# EAGLE design HighVoltageOutputMirror (EAGLE 9.0.1)
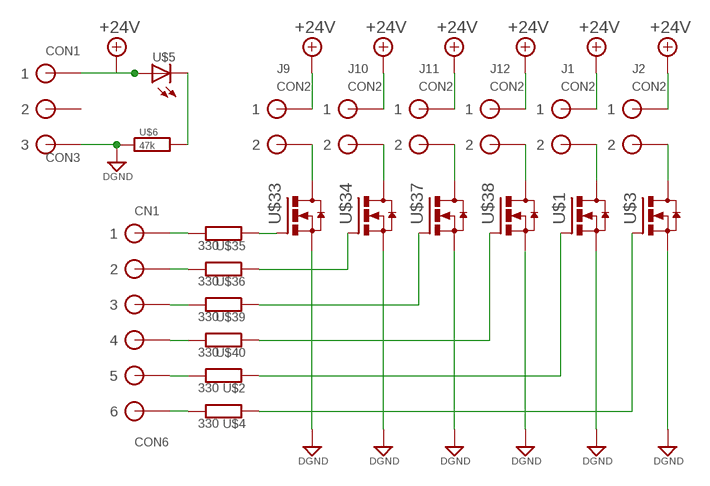
[diagram p0: schematic, sheet 1]

## Parts
CN1  CON6  [CON6]
CON1  CON3  [CON3]
J1  CON2  [CON2]
J2  CON2  [CON2]
J9  CON2  [CON2]
J10  CON2  [CON2]
J11  CON2  [CON2]
J12  CON2  [CON2]
U$1  TO-252(MOS-FET_N)TO-252FORHAND  [TO-252FORHAND]
U$2  330  抵抗0207/10  [1/4W-H4_(0207/10)]
U$3  TO-252(MOS-FET_N)TO-252FORHAND  [TO-252FORHAND]
U$4  330  抵抗0207/10  [1/4W-H4_(0207/10)]
U$5  LED(砲弾型)3  [LED3MM]
U$6  47k  抵抗0805  [0805(JIS2012)HAND]
U$33  TO-252(MOS-FET_N)TO-252FORHAND  [TO-252FORHAND]
U$34  TO-252(MOS-FET_N)TO-252FORHAND  [TO-252FORHAND]
U$35  330  抵抗0207/10  [1/4W-H4_(0207/10)]
U$36  330  抵抗0207/10  [1/4W-H4_(0207/10)]
U$37  TO-252(MOS-FET_N)TO-252FORHAND  [TO-252FORHAND]
U$38  TO-252(MOS-FET_N)TO-252FORHAND  [TO-252FORHAND]
U$39  330  抵抗0207/10  [1/4W-H4_(0207/10)]
U$40  330  抵抗0207/10  [1/4W-H4_(0207/10)]

## Nets
+24V: CON1.P$1 J1.P$1 J2.P$1 J9.P$1 J10.P$1 J11.P$1 J12.P$1 U$5.A
DGND: CON1.P$3 U$1.2(S) U$3.2(S) U$6.1 U$33.2(S) U$34.2(S) U$37.2(S) U$38.2(S)
N$1: CN1.P$5 U$2.2
N$2: U$1.1(G) U$2.1
N$3: J1.P$2 U$1.3(D)
N$4: CN1.P$6 U$4.2
N$5: U$3.1(G) U$4.1
N$6: J2.P$2 U$3.3(D)
N$7: CN1.P$2 U$36.2
N$8: U$5.K U$6.2
N$25: CN1.P$1 U$35.2
N$27: CN1.P$3 U$39.2
N$28: CN1.P$4 U$40.2
N$32: U$33.1(G) U$35.1
N$33: U$34.1(G) U$36.1
N$34: J9.P$2 U$33.3(D)
N$35: J10.P$2 U$34.3(D)
N$36: U$37.1(G) U$39.1
N$37: U$38.1(G) U$40.1
N$38: J11.P$2 U$37.3(D)
N$39: J12.P$2 U$38.3(D)
Unconnected: CON1.P$2

## Library data of the parts
CN1 = (コネクタ)XH:CON6: low insertion connector 6
CON1 = (コネクタ)XH:CON3: low insertion CON
J1 J2 J9-J12 = (コネクタ)XH:CON2: low insertion CON
U$1 U$3 U$33 U$34 U$37 U$38 = (半導体)FET＆トランジスタ:TO-252(MOS-FET_N)
U$2 U$4 U$35 U$36 U$39 U$40 = (Foundation)抵抗:抵抗: RESISTOR, European symbol
U$5 = (半導体)LED:LED(砲弾型)
U$6 = (Foundation)表面実装RC:抵抗

## Board
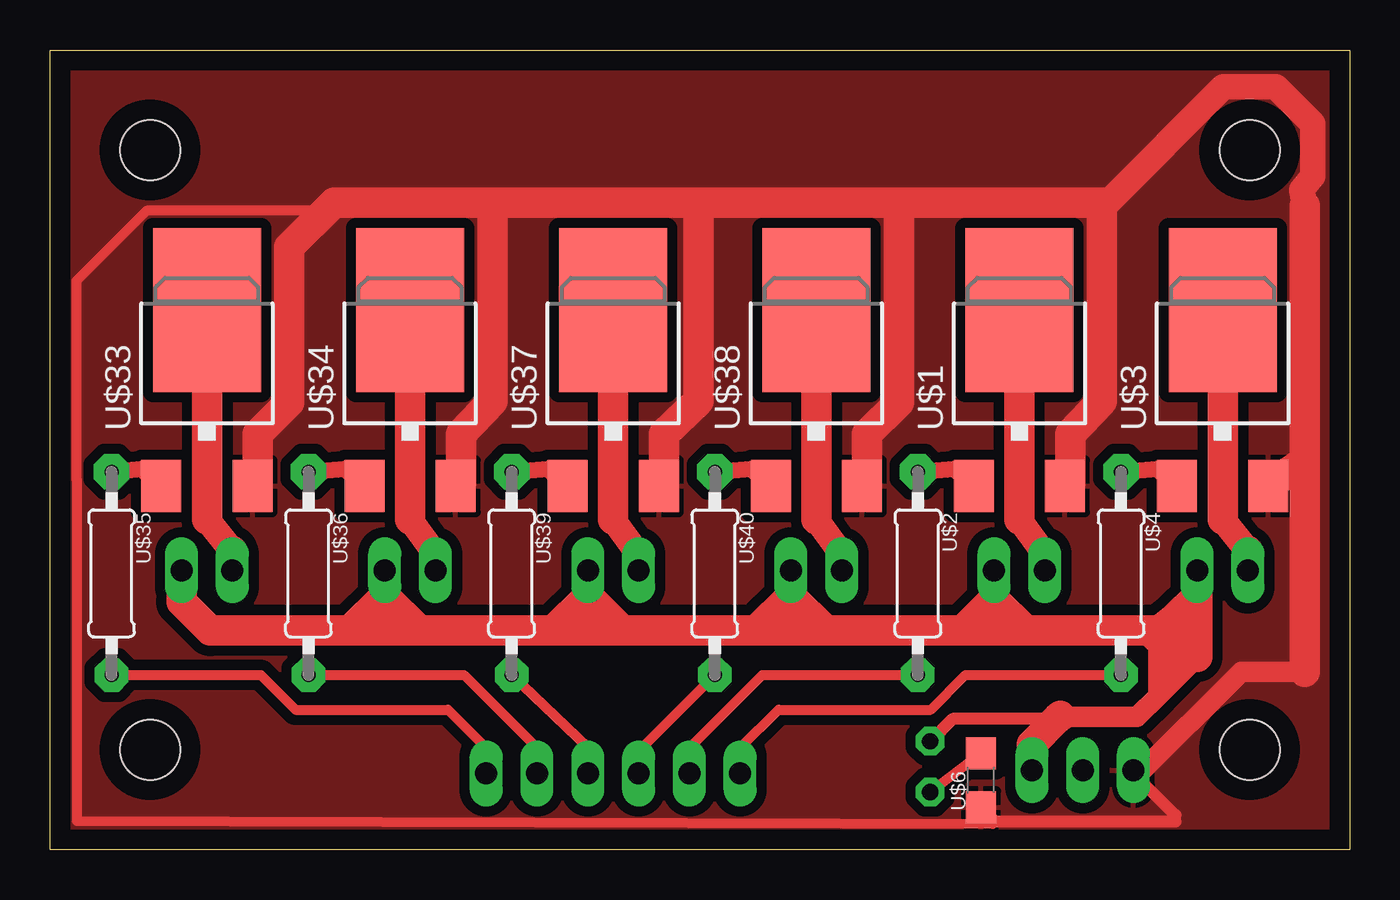
[diagram p1: board, top side]
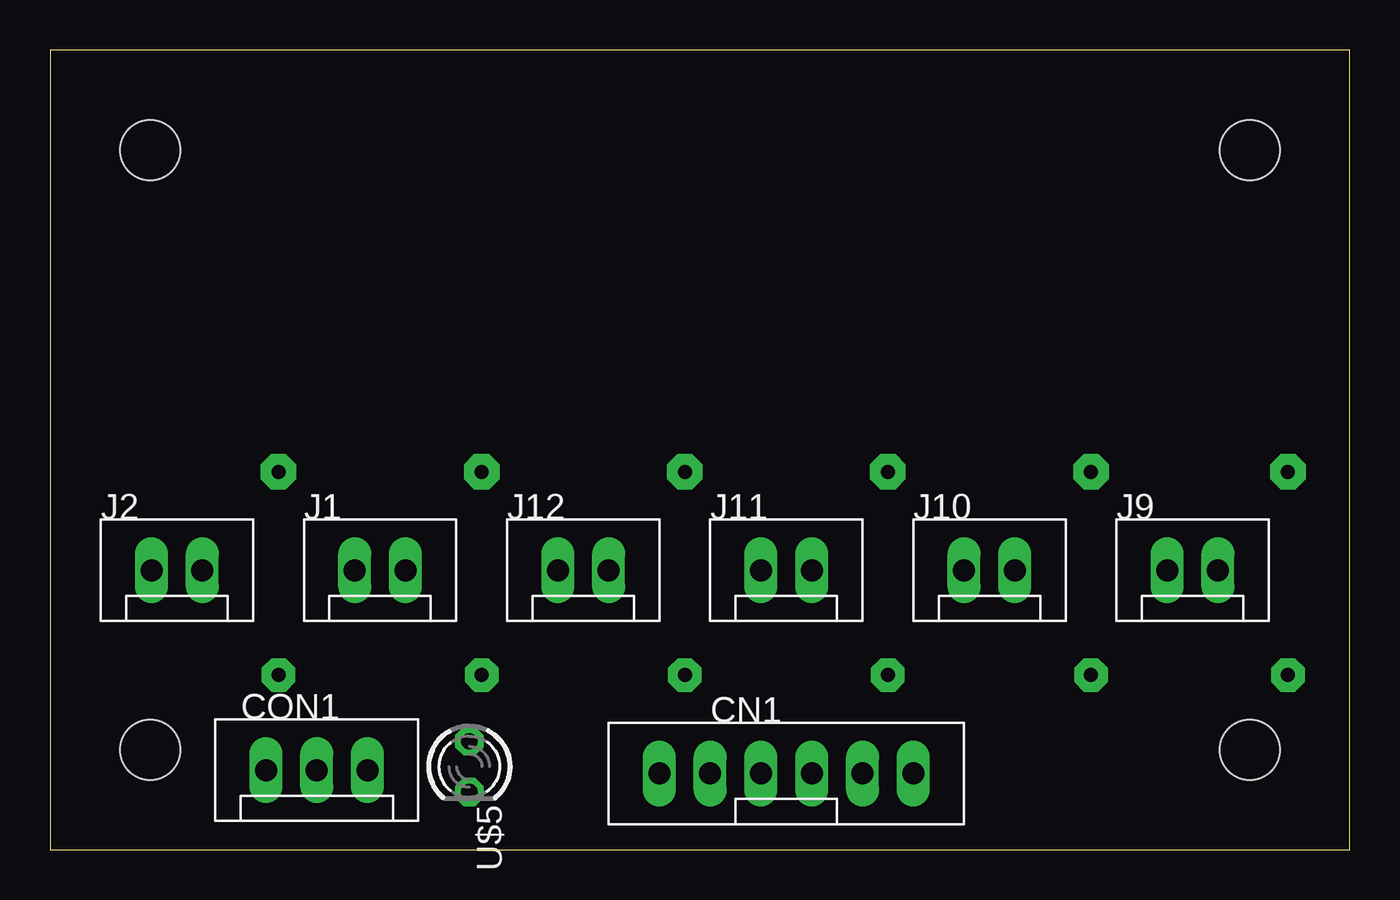
[diagram p2: board, bottom side, seen from below]

Size 65 x 40 mm. Coordinates in mm from the lower left corner, seen from the top.
Outline: 65,0 0,0 0,40 65,40 65,0
Copper layers (1*16): Top 0.035mm / dielectric 1.5mm / Bottom 0.035mm
Design rules "default *": minimum track width 6mil, minimum drill 0.35mm, track to track 20mil, track to pad 20mil, pad to pad 20mil, via to via 20mil, smd to smd 6mil, copper to edge 40mil, drill to drill 6mil, minimum pad ring 10mil, minimum via ring 8mil, stop-mask expansion 4mil, vias tented up to drill 0mil, thermal gap 10mil
Holes 3 mm at 60,5 5,5 5,35 60,35

### Footprints (pad centres in the part's own frame; a part is rotated, then mirrored left to right if it is on the bottom)
CON6 = drill 1.1 long: P$1 6.35,0; P$2 3.81,0; P$3 1.27,0; P$4 -1.27,0; P$5 -3.81,0; P$6 -6.35,0
CON3 = drill 1.1 long: P$1 2.54,0; P$2 0,0; P$3 -2.54,0
CON2 = drill 1.1 long: P$1 1.27,0; P$2 -1.27,0
TO-252FORHAND = smd 2 x 2.6: 1 -2.28,-5.3; 2 2.28,-5.3 | smd 5.4 x 8.2: 3 0,3.5
1/4W-H4_(0207/10) = drill 0.7 pad 1.778 octagon: 1 -5.08,0 | drill 0.7 pad 1.676 octagon: 2 5.08,0
LED3MM = drill 0.813 pad 1.422 octagon: A -1.27,0; K 1.27,0
0805(JIS2012)HAND = smd 1.6 x 1.5: 1 -1.35,0; 2 1.35,0

### Placement (x,y rotation side)
CN1  28.17,3.81 0 bottom
CON1  51.66,3.97 0 bottom
J1  48.49,13.97 0 bottom
J2  58.65,13.97 0 bottom
J9  7.85,13.97 0 bottom
J10  18.01,13.97 0 bottom
J11  28.17,13.97 0 bottom
J12  38.33,13.97 0 bottom
U$1  48.49,23.48 0 top
U$2  43.41,13.81 270 top
U$3  58.65,23.48 0 top
U$4  53.57,13.81 270 top
U$5  44.03,4.15 270 bottom
U$6  46.56,3.47 90 top
U$33  7.85,23.48 0 top
U$34  18.01,23.48 0 top
U$35  3.08,13.81 270 top
U$36  12.93,13.81 270 top
U$37  28.17,23.48 0 top
U$38  38.33,23.48 0 top
U$39  23.09,13.81 270 top
U$40  33.25,13.81 270 top

### Tracks (layer width: path | path; a pad name or v marks a point on that pad's centre or on a via)
+24V
  Top 0.61: 50.37,6.53 45.14,6.53 U$5.A
  Top 1.016: 50.37,6.53 50.79,6.53 50.89,6.63 54.37,6.63 55.43,7.7 | 55.43,7.7 57.38,9.64 | 56.13,9.8 55.43,9.1 | 55.43,9.1 55.43,7.7 | 55.43,9.1 55.43,10.91 55.47,10.95
  Top 1.524: 56.24,11.56 57.38,12.7 J2.P$1 57.38,9.64 | 56.24,11.56 55.47,10.95 | 55.47,10.95 48.81,10.95 | 48.81,10.95 47.22,12.54 | 47.22,12.54 45.63,10.95 | 45.63,10.95 38.81,10.95 | 38.81,10.95 37.06,12.7 | 37.06,12.7 J12.P$1 37.06,11.11 37.38,10.95 | 37.06,12.7 35.31,10.95 | 35.31,10.95 28.65,10.95 | 28.65,10.95 26.9,12.7 | 26.9,12.7 J11.P$1 26.9,11.11 26.58,10.95 | 26.9,12.7 25.15,10.95 | 25.15,10.95 18.49,10.95 | 18.49,10.95 16.74,12.7 | 16.74,12.7 J10.P$1 16.74,10.95 | 16.74,12.7 14.99,10.95 | 14.99,10.95 8.02,10.95 6.58,12.39 J9.P$1 | 55.32,10.64 55.47,10.95 | 48.81,10.95 46.75,10.95 | 46.75,10.95 45.63,10.95 | 38.81,10.95 37.38,10.95 | 37.38,10.95 35.31,10.95 | 28.65,10.95 26.58,10.95 | 26.58,10.95 25.15,10.95 | 14.99,10.95 16.74,10.95 | 16.74,10.95 18.49,10.95 | J1.P$1 47.22,12.54 | 47.22,12.54 47.22,11.11 46.75,10.95 | CON1.P$1 49.12,5.27 50.37,6.53 50.53,6.69 | 55.59,10.68 55.47,10.95 | 56.24,11.56 56.24,9.85 56.29,9.8 56.13,9.8
DGND
  Top 0.508: 14.2,32.37 13.79,31.95 4.83,31.95 1.32,28.45 1.32,18.51 1.34,18.49 1.34,1.43 47.16,1.28
  Top 0.61: U$6.1 47.23,1.4 56.29,1.4 56.29,1.72 54.35,3.66 CON1.P$3
  Top 1.016: 62.77,8.89 59.58,8.89 54.35,3.66
  Top 1.27: 62.77,32.21 62.62,33 63.15,33.7 63.15,36.3 61.31,38.15 58.69,38.15 52.91,32.37 52.61,32.37
  Top 1.524: U$33.2 10.39,18.32 10.39,20.79 11.97,22.37 11.97,30.14 14.2,32.37 22.13,32.37 | 22.13,32.37 22.13,22.44 20.55,20.79 20.55,18.32 U$34.2 | 22.13,32.37 32.45,32.37 | 32.45,32.37 32.45,22.44 30.71,20.79 30.71,18.32 U$37.2 | 32.45,32.37 42.45,32.37 | 42.45,32.37 42.45,22.37 40.87,20.79 40.87,18.32 U$38.2 | 42.45,32.37 52.61,32.37 52.61,22.44 51.03,20.79 51.03,18.32 U$1.2 | 62.77,19.43 62.77,32.21 | 62.77,19.43 U$3.2 | 62.77,19.43 62.77,8.89
  pour Top: 65,0 65,40 0,40 0,0
N$1
  Top 0.508: CN1.P$5 31.98,5.08 35.63,8.73 U$2.2
N$2
  Top 0.813: U$2.1 45.22,19.05 U$1.1
N$3
  Top 1.27: 49.76,14.77 48.49,16.51
  Top 1.524: J1.P$2 49.76,14.77 | 48.49,16.51 U$1.3
N$4
  Top 0.508: CN1.P$6 34.52,5.08 36.44,7 44.06,7 45.79,8.73 U$4.2
N$5
  Top 0.813: U$4.1 55.38,19.05 U$3.1
N$6
  Top 1.27: 58.65,16.51 59.92,14.93
  Top 1.524: U$3.3 58.65,16.51 | 59.92,14.93 J2.P$2
N$7
  Top 0.508: U$36.2 20.71,8.73 24.36,5.08 CN1.P$2
N$8
  Top 0.508: U$5.K U$6.2
N$25
  Top 0.508: U$35.2 10.55,8.73 12.28,7 19.9,7 21.82,5.08 CN1.P$1
N$27
  Top 0.508: U$39.2 26.9,5.08 CN1.P$3
N$28
  Top 0.508: CN1.P$4 29.44,4.92 U$40.2
N$32
  Top 0.813: U$35.1 4.58,19.05 U$33.1
N$33
  Top 0.813: U$36.1 14.74,19.05 U$34.1
N$34
  Top 1.27: 7.85,16.51 9.12,14.93
  Top 1.524: U$33.3 7.85,16.51 | 9.12,14.93 J9.P$2
N$35
  Top 1.27: 18.01,16.51 19.28,14.77
  Top 1.524: U$34.3 18.01,16.51 | 19.28,14.77 J10.P$2
N$36
  Top 0.813: U$39.1 24.9,19.05 U$37.1
N$37
  Top 0.813: U$40.1 35.06,19.05 U$38.1
N$38
  Top 1.27: 28.17,16.51 29.44,14.77
  Top 1.524: U$37.3 28.17,16.51 | 29.44,14.77 J11.P$2
N$39
  Top 1.27: 38.33,16.51 39.6,14.77
  Top 1.524: U$38.3 38.33,16.51 | 39.6,14.77 J12.P$2